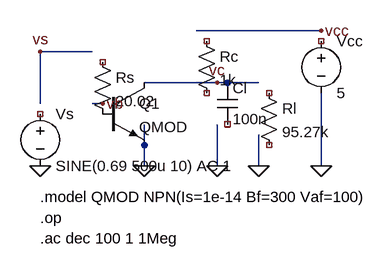
[diagram p0: schematic ce_loaded.asc]
ce_loaded.asc, the LTspice schematic file:
Version 4
SHEET 1 1200 680
WIRE 48 160 48 80
WIRE 48 80 128 80
WIRE 128 160 144 160
WIRE 208 128 288 128
WIRE 288 128 320 128
WIRE 320 128 384 128
WIRE 288 48 480 48
WIRE 208 192 208 256
WIRE 320 192 320 256
WIRE 384 208 384 256
WIRE 480 144 480 256
FLAG 48 256 0
FLAG 208 256 0
FLAG 320 256 0
FLAG 384 256 0
FLAG 480 256 0
FLAG 48 80 vs
FLAG 144 160 vb
FLAG 320 128 vc
FLAG 480 48 vcc
SYMBOL voltage 48 160 R0
WINDOW 123 24 124 Left 2
WINDOW 39 0 0 Left 2
SYMATTR InstName Vs
SYMATTR Value SINE(0.69 500u 10) AC 1
SYMBOL res 128 80 R0
SYMATTR InstName Rs
SYMATTR Value 20.02
SYMBOL npn 144 128 R0
SYMATTR InstName Q1
SYMATTR Value QMOD
SYMBOL res 288 48 R0
SYMATTR InstName Rc
SYMATTR Value 1k
SYMBOL cap 320 128 R0
SYMATTR InstName Cl
SYMATTR Value 100n
SYMBOL res 384 128 R0
SYMATTR InstName Rl
SYMATTR Value 95.27k
SYMBOL voltage 480 48 R0
SYMATTR InstName Vcc
SYMATTR Value 5
TEXT 48 304 Left 2 !.model QMOD NPN(Is=1e-14 Bf=300 Vaf=100)
TEXT 48 336 Left 2 !.op
TEXT 48 368 Left 2 !.ac dec 100 1 1Meg

The netlist it stands for:
* ce_loaded.asc
Vs NC_01 0 SINE(0.69 500u 10) AC 1
Rs NC_02 P001 20.02
Q1 vc P001 0 0 QMOD
Rc NC_03 NC_04 1k
Cl vc NC_05 100n
Rl NC_06 NC_07 95.27k
Vcc NC_08 0 5
.model NPN NPN
.model PNP PNP
.lib standard.bjt
.model QMOD NPN(Is=1e-14 Bf=300 Vaf=100)
.op
.ac dec 100 1 1Meg
.backanno
.end